# Altium schematic sheet FPGA_VCC.SchDoc
size A
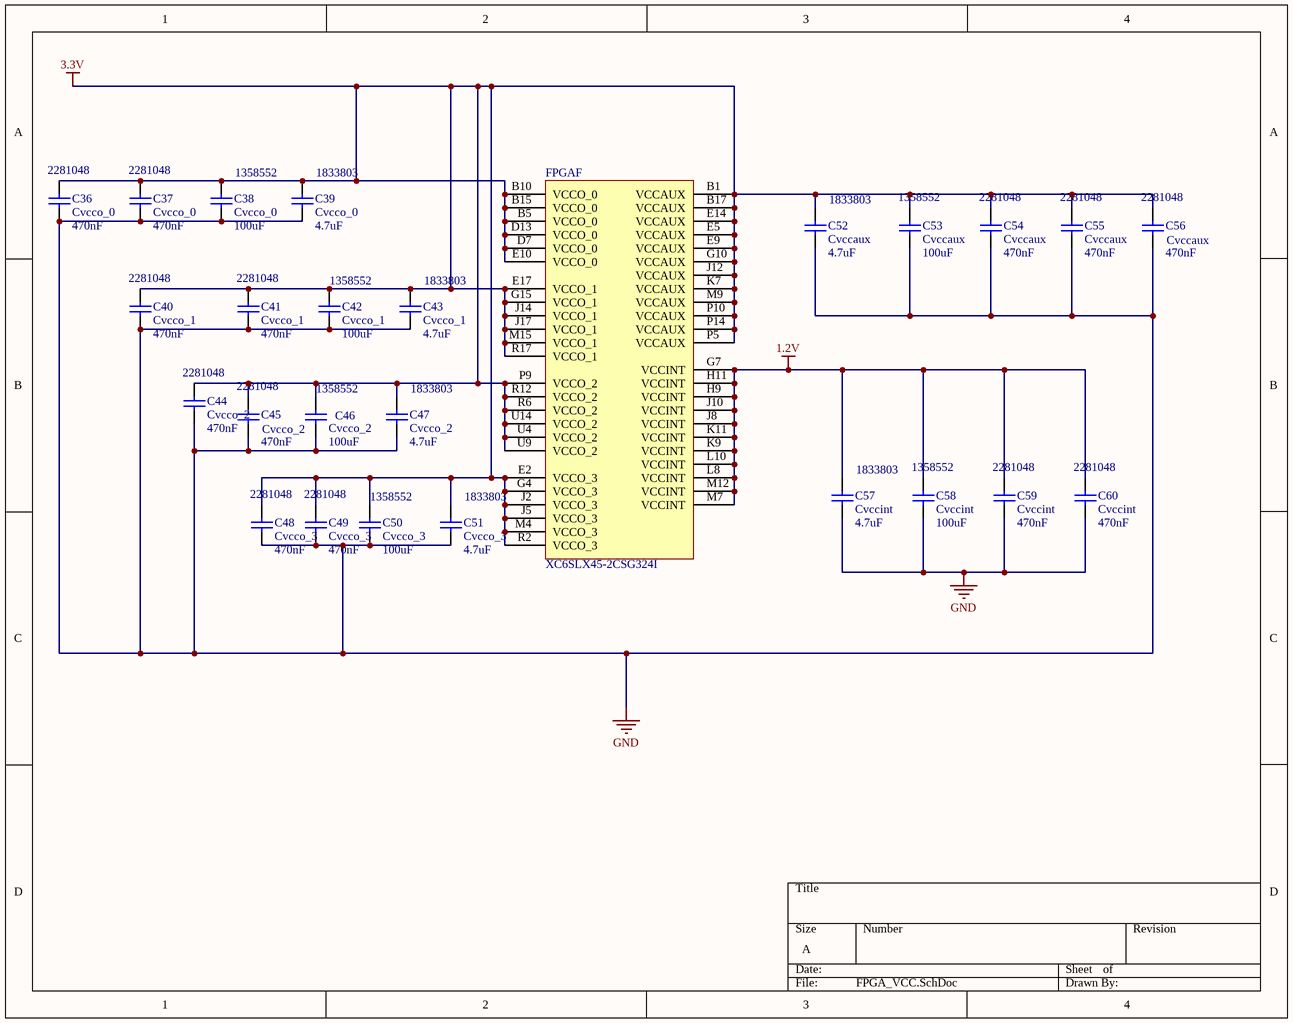
[diagram p0: FPGA_VCC.SchDoc]

## Parts
C36  Cvcco_0  value 470nF  Supplier Part Number 1: 2281048  [C1206]
C37  Cvcco_0  value 470nF  Supplier Part Number 1: 2281048  [C1206]
C38  Cvcco_0  value 100uF  Supplier Part Number 1: 1358552  [C1206]
C39  Cvcco_0  value 4.7uF  Supplier Part Number 1: 1833803  [C1206]
C40  Cvcco_1  value 470nF  Supplier Part Number 1: 2281048  [C1206]
C41  Cvcco_1  value 470nF  Supplier Part Number 1: 2281048  [C1206]
C42  Cvcco_1  value 100uF  Supplier Part Number 1: 1358552  [C1206]
C43  Cvcco_1  value 4.7uF  Supplier Part Number 1: 1833803  [C1206]
C44  Cvcco_2  value 470nF  Supplier Part Number 1: 2281048  [C1206]
C45  Cvcco_2  value 470nF  Supplier Part Number 1: 2281048  [C1206]
C46  Cvcco_2  value 100uF  Supplier Part Number 1: 1358552  [C1206]
C47  Cvcco_2  value 4.7uF  Supplier Part Number 1: 1833803  [C1206]
C48  Cvcco_3  value 470nF  Supplier Part Number 1: 2281048  [C1206]
C49  Cvcco_3  value 470nF  Supplier Part Number 1: 2281048  [C1206]
C50  Cvcco_3  value 100uF  Supplier Part Number 1: 1358552  [C1206]
C51  Cvcco_3  value 4.7uF  Supplier Part Number 1: 1833803  [C1206]
C52  Cvccaux  value 4.7uF  Supplier Part Number 1: 1833803  [C1206]
C53  Cvccaux  value 100uF  Supplier Part Number 1: 1358552  [C1206]
C54  Cvccaux  value 470nF  Supplier Part Number 1: 2281048  [C1206]
C55  Cvccaux  value 470nF  Supplier Part Number 1: 2281048  [C1206]
C56  Cvccaux  value 470nF  Supplier Part Number 1: 2281048  [C1206]
C57  Cvccint  value 4.7uF  Supplier Part Number 1: 1833803  [C1206]
C58  Cvccint  value 100uF  Supplier Part Number 1: 1358552  [C1206]
C59  Cvccint  value 470nF  Supplier Part Number 1: 2281048  [C1206]
C60  Cvccint  value 470nF  Supplier Part Number 1: 2281048  [C1206]
FPGA  XC6SLX45-2CSG324I  [CSG324]  (part F of 8)

## Nets
1.2V: C57.2 C58.2 C59.1 C60.1 FPGA.G7(VCCINT) FPGA.H9(VCCINT) FPGA.H11(VCCINT) FPGA.J8(VCCINT) FPGA.J10(VCCINT) FPGA.K9(VCCINT) FPGA.K11(VCCINT) FPGA.L8(VCCINT) FPGA.L10(VCCINT) FPGA.M7(VCCINT) FPGA.M12(VCCINT)
3.3V: C36.1 C37.1 C38.2 C39.2 C40.1 C41.1 C42.1 C43.2 C44.1 C45.1 C46.2 C47.2 C48.1 C49.1 C50.2 C51.2 C52.2 C53.2 C54.1 C55.1 C56.1 FPGA.B1(VCCAUX) FPGA.B5(VCCO_0) FPGA.B10(VCCO_0) FPGA.B15(VCCO_0) FPGA.B17(VCCAUX) FPGA.D7(VCCO_0) FPGA.D13(VCCO_0) FPGA.E2(VCCO_3) FPGA.E5(VCCAUX) FPGA.E9(VCCAUX) FPGA.E10(VCCO_0) FPGA.E14(VCCAUX) FPGA.E17(VCCO_1) FPGA.G4(VCCO_3) FPGA.G10(VCCAUX) FPGA.G15(VCCO_1) FPGA.J2(VCCO_3) FPGA.J5(VCCO_3) FPGA.J12(VCCAUX) FPGA.J14(VCCO_1) FPGA.J17(VCCO_1) FPGA.K7(VCCAUX) FPGA.M4(VCCO_3) FPGA.M9(VCCAUX) FPGA.M15(VCCO_1) FPGA.P5(VCCAUX) FPGA.P9(VCCO_2) FPGA.P10(VCCAUX) FPGA.P14(VCCAUX) FPGA.R2(VCCO_3) FPGA.R6(VCCO_2) FPGA.R12(VCCO_2) FPGA.R17(VCCO_1) FPGA.U4(VCCO_2) FPGA.U9(VCCO_2) FPGA.U14(VCCO_2)
GND: C36.2 C37.2 C38.1 C39.1 C40.2 C41.2 C42.2 C43.1 C44.2 C45.2 C46.1 C47.1 C48.2 C49.2 C50.1 C51.1 C52.1 C53.1 C54.2 C55.2 C56.2 C57.1 C58.1 C59.2 C60.2

## Library data of the parts
C36 C37 C40 C41 C44 C45 C48 C49 C54-C56 C59 C60 = Cap Semi: Capacitor (Semiconductor SIM Model); Manufacturer: AVX; Manufacturer Part Number: 12061C474KAT2A; Published: 8-Jun-2000; LatestRevisionDate: 29-May-2009; LatestRevisionNote: IPC-7351 Footprint Added.; PackageReference: C1206; Publisher: Altium Limited; PackageDescription: Chip Capacitor; Supplier 1: Farnell; RoHS: YES; Stock 1: 70000; Pricing 1: 2000=0.648, 10000=0.56, 20000=0.504 (EUR); ComponentLink1URL: http://www.farnell.com/datasheets/1679506.pdf; ComponentLink1Description: http://www.farnell.com/datasheets/1679506.pdf
C38 C42 C46 C50 C53 C58 = Cap Semi: Capacitor (Semiconductor SIM Model); Manufacturer: KEMET; Manufacturer Part Number: C1206C107M9PACTU; Product Range: KEMET - C Series; Capacitance: 100; Capacitance Tolerance: ± 20%; Dielectric Characteristic: X5; Voltage Rating: 6.3; Ceramic Capacitor Case: 1206 [3216 Metric]; SVHC: No SVHC (16-Dec-2013); Capacitor Terminals: SMD; Published: 8-Jun-2000; LatestRevisionDate: 29-May-2009; LatestRevisionNote: IPC-7351 Footprint Added.; PackageReference: C1206; Publisher: Altium Limited; PackageDescription: Chip Capacitor; Supplier 1: Farnell; RoHS: YES; Stock 1: 24189; Pricing 1: 1=5.39, 100=3.03, 1000=2.68, 4000=2.6 (EUR); Operating Temperature Min: -55; Operating Temperature Max: 85; Packaging: Cut Tape; MSL: MSL 1 - Unlimited; Capacitance Tolerance ±: ± 20%; Capacitor Case Style: 1206 [3216 Metric]; Operating Temperature Range: -55°C to +85; Terminal Type: Surface Mount (SMD, SMT)<!--FANDB--><div class="features-and-benefits-container"></div>; ComponentLink1URL: http://www.farnell.com/datasheets/1732717.pdf; ComponentLink1Description: http://www.farnell.com/datasheets/1732717.pdf; ComponentLink2URL: http://www.farnell.com/cad/1558721.zip; ComponentLink2Description: http://www.farnell.com/cad/1558721.zip
  C42 C46: ComponentLink3URL: http://www.farnell.com/datasheets/1679506.pdf; ComponentLink3Description: http://www.farnell.com/datasheets/1679506.pdf
C39 C43 C47 C51 C52 C57 = Cap Semi: Capacitor (Semiconductor SIM Model); Manufacturer: AVX; Manufacturer Part Number: 06036D475KAT2A; Published: 8-Jun-2000; LatestRevisionDate: 29-May-2009; LatestRevisionNote: IPC-7351 Footprint Added.; PackageReference: C1206; Publisher: Altium Limited; PackageDescription: Chip Capacitor; Supplier 1: Farnell; RoHS: YES; Stock 1: 17276; Pricing 1: 10=1.65, 100=1.02, 500=0.44, 1000=0.36, 2000=0.29 (EUR); ComponentLink1URL: http://www.farnell.com/datasheets/1796776.pdf; ComponentLink1Description: http://www.farnell.com/datasheets/1796776.pdf
FPGA = CMP-0067-00402-1: Spartan-6 LX 1.2V FPGA, 218 User I/Os, 324-Ball Chip-Scale BGA (0.8mm Pitch), Speed Grade 2, Industrial Grade, Pb-Free; Code_JEDEC: MO-275-KKAC-1; PackageDescription: 324-Ball Chip-Scale BGA (CSG324) Package, 0.8 mm Pitch; DatasheetVersion: ver1.6, Nov-2010; PackageVersion: ver1.1, Nov-2009; PackageReference: CSG324